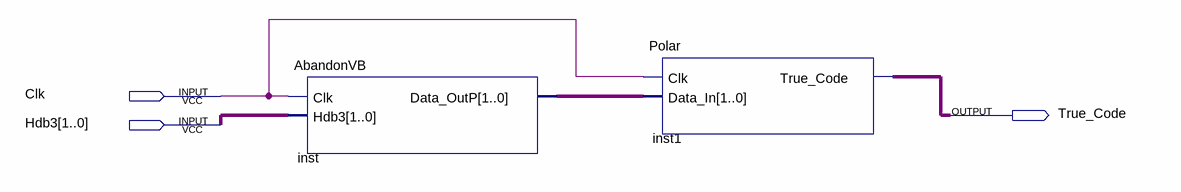
[diagram p0: schematic sheet]
// Quartus schematic Hdb3.bdf as structural Verilog: 2 symbols, 3 pins
module Hdb3 (
  input  Clk,
  input  [1:0] Hdb3,
  output True_Code
);

  wire [1:0] inst_data_outp;

  AbandonVB inst (.Clk(Clk), .Hdb3(Hdb3), .Data_OutP(inst_data_outp));
  Polar inst1 (.Clk(Clk), .Data_In(inst_data_outp), .True_Code(True_Code));
endmodule
